# Altium schematic sheet MAX110431.SchDoc
size A4
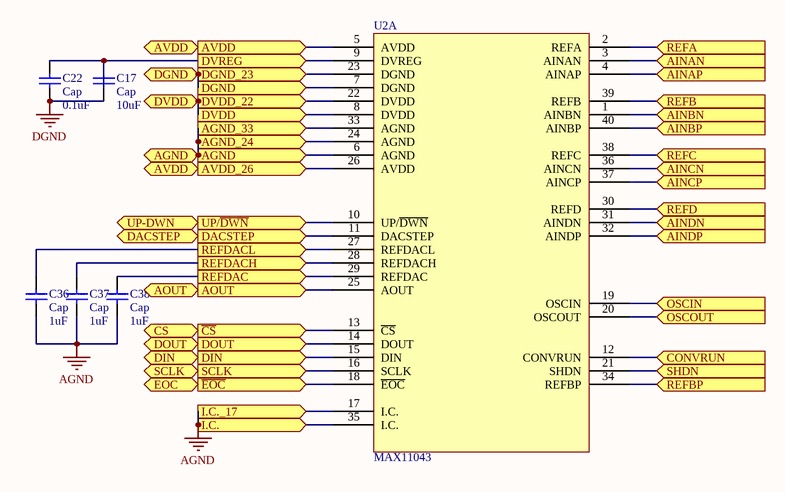
[diagram p0: MAX110431.SchDoc]

## Parts
C17  Cap  value 10uF  [RAD-0.3]
C22  Cap  value 0.1uF  [RAD-0.3]
C36  Cap  value 1uF  [RAD-0.3]
C37  Cap  value 1uF  [RAD-0.3]
C38  Cap  value 1uF  [RAD-0.3]
U2A  MAX11043

## Ports
AGND, AGND_24, AGND_33, AINAN, AINAP, AINBN, AINBP, AINCN, AINCP, AINDN, AINDP, AOUT, AVDD, AVDD_26, CONVRUN, CS, DACSTEP, DGND, DGND_23, DIN, DOUT, DVDD, DVDD_22, DVREG, EOC, I.C., I.C._17, OSCIN, OSCOUT, REFA, REFB, REFBP, REFC, REFD, REFDAC, REFDACH, REFDACL, SCLK, SHDN, UP-DWN, UP/~{DWN}, ~{CS}, ~{EOC}

## Nets
AGND: C36.1 C37.2 C38.1 U2A.17(I.C.) U2A.35(I.C.) ; port I.C., port I.C._17
DGND: C17.2 C22.2
AGND: U2A.6(AGND) U2A.24(AGND) U2A.33(AGND) ; port AGND, port AGND_24, port AGND_33  [a separate net that carries the same name]
AINAN: U2A.3(AINAN) ; port AINAN
AINAP: U2A.4(AINAP) ; port AINAP
AINBN: U2A.1(AINBN) ; port AINBN
AINBP: U2A.40(AINBP) ; port AINBP
AINCN: U2A.36(AINCN) ; port AINCN
AINCP: U2A.37(AINCP) ; port AINCP
AINDN: U2A.31(AINDN) ; port AINDN
AINDP: U2A.32(AINDP) ; port AINDP
AOUT: U2A.25(AOUT) ; port AOUT
AVDD: U2A.5(AVDD) U2A.26(AVDD) ; port AVDD, port AVDD_26
~{CS}: U2A.13(~{CS}) ; port ~{CS}, port CS
CONVRUN: U2A.12(CONVRUN) ; port CONVRUN
DACSTEP: U2A.11(DACSTEP) ; port DACSTEP
DGND: U2A.7(DGND) U2A.23(DGND) ; port DGND, port DGND_23  [a separate net that carries the same name]
DIN: U2A.15(DIN) ; port DIN
DOUT: U2A.14(DOUT) ; port DOUT
DVDD: U2A.8(DVDD) U2A.22(DVDD) ; port DVDD, port DVDD_22
DVREG: C17.1 C22.1 U2A.9(DVREG) ; port DVREG
~{EOC}: U2A.18(~{EOC}) ; port ~{EOC}, port EOC
OSCIN: U2A.19(OSCIN) ; port OSCIN
OSCOUT: U2A.20(OSCOUT) ; port OSCOUT
REFA: U2A.2(REFA) ; port REFA
REFB: U2A.39(REFB) ; port REFB
REFBP: U2A.34(REFBP) ; port REFBP
REFC: U2A.38(REFC) ; port REFC
REFD: U2A.30(REFD) ; port REFD
REFDAC: C38.2 U2A.29(REFDAC) ; port REFDAC
REFDACH: C37.1 U2A.28(REFDACH) ; port REFDACH
REFDACL: C36.2 U2A.27(REFDACL) ; port REFDACL
SCLK: U2A.16(SCLK) ; port SCLK
SHDN: U2A.21(SHDN) ; port SHDN
UP-DWN: U2A.10(UP/~{DWN}) ; port UP/~{DWN}, port UP-DWN

## Library data of the parts
C17 C22 C36-C38 = Cap: Capacitor; Published: 8-Jun-2000; LatestRevisionDate: 17-Jul-2002; LatestRevisionNote: Re-released for DXP Platform.; PackageReference: RAD-0.3; Publisher: Altium Limited; PackageDescription: Radial Cap, Thru-Hole; 2 Leads; 0.3 in Pin Spacing